# EAGLE design logic_pirate (EAGLE 6.4)
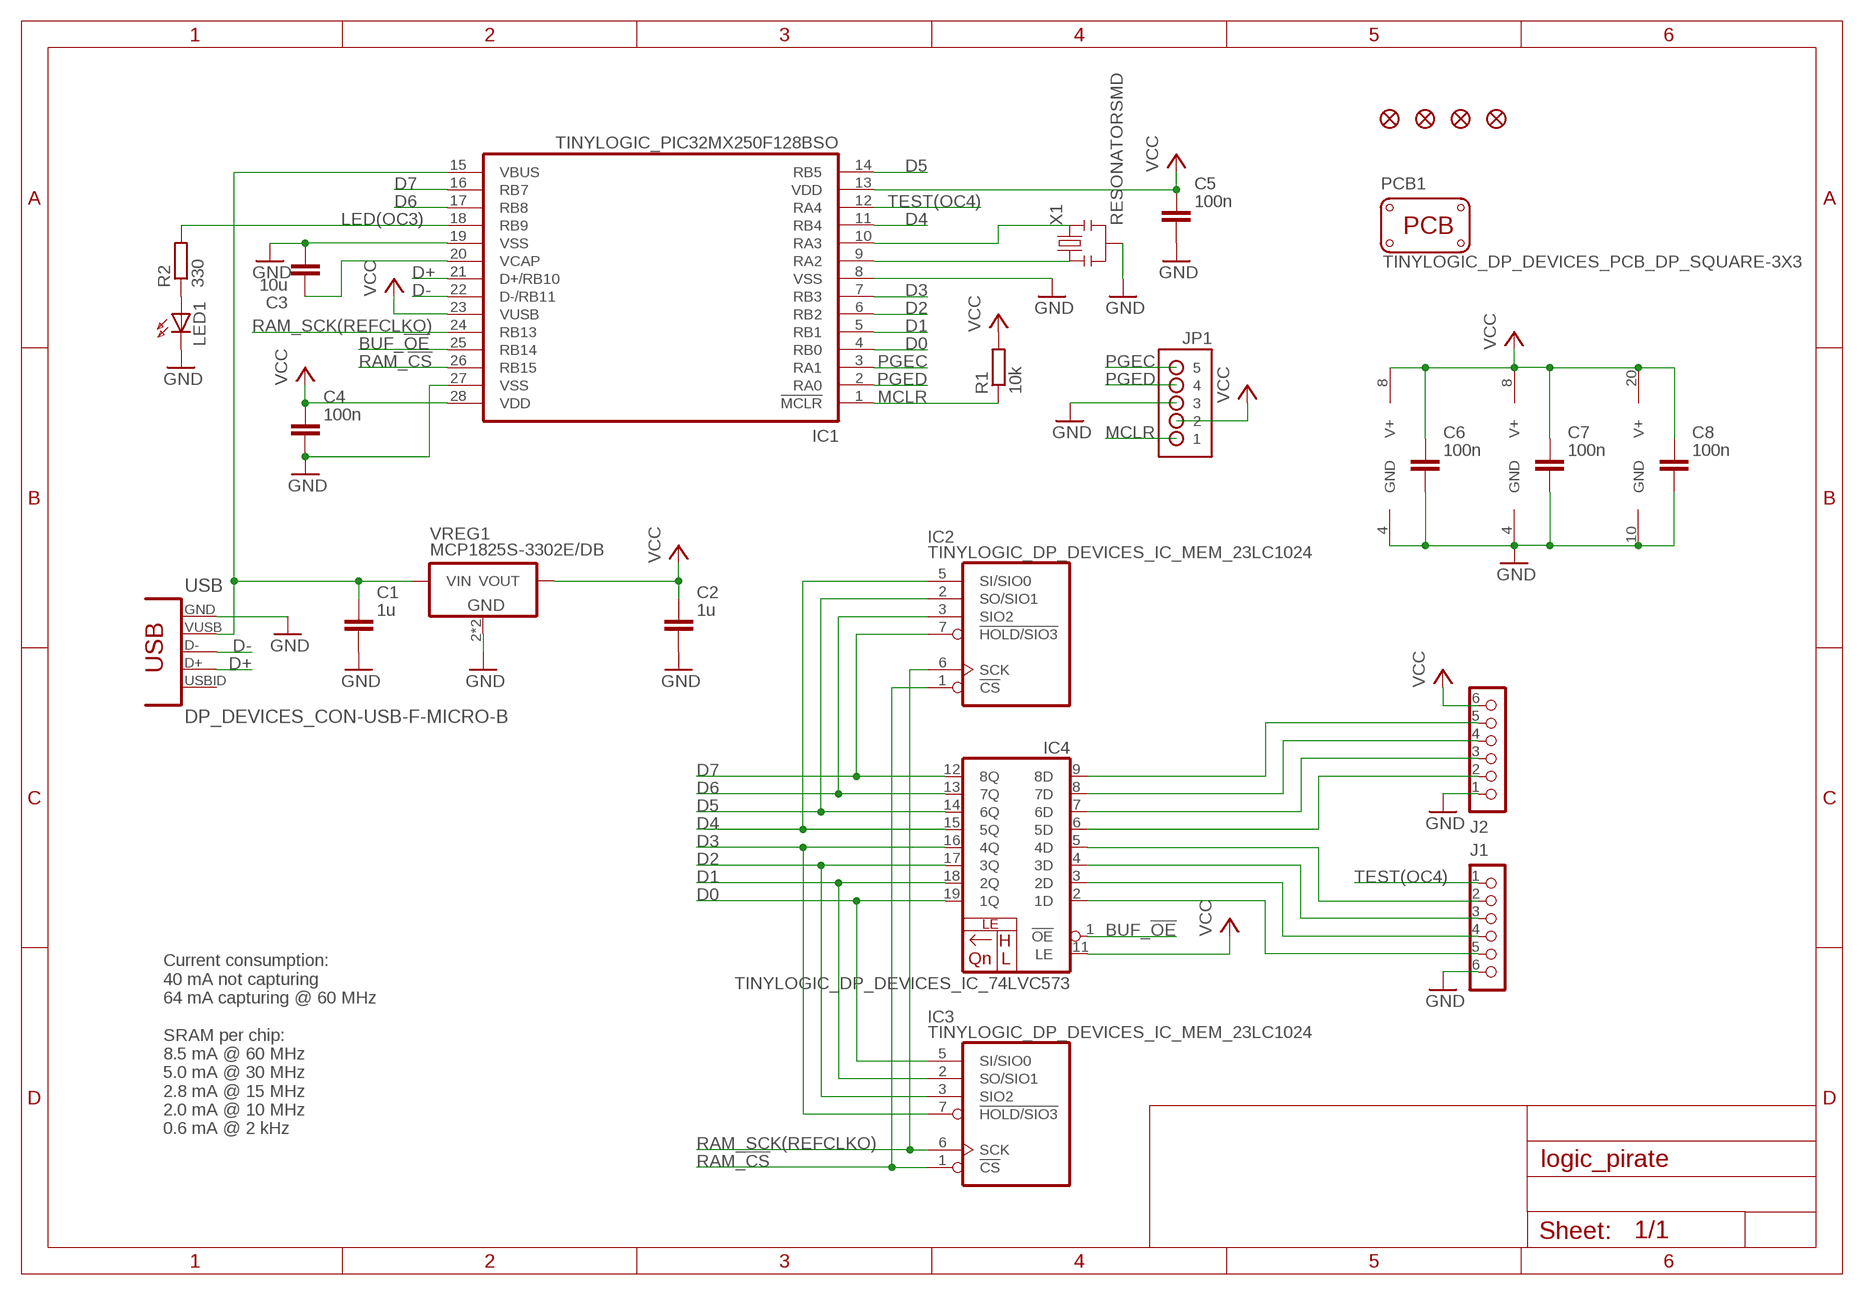
[diagram p0: schematic, sheet 1]

## Parts
C1  1u  DP_DEVICES_CAPACITOR_NPOL-0603  [DP_DEVICES_C603]
C2  1u  DP_DEVICES_CAPACITOR_NPOL-0603  [DP_DEVICES_C603]
C3  10u  CAPACITOR_NPOL-1206  [C1206]
C4  100n  DP_DEVICES_CAPACITOR_NPOL-0603  [DP_DEVICES_C603]
C5  100n  DP_DEVICES_CAPACITOR_NPOL-0603  [DP_DEVICES_C603]
C6  100n  DP_DEVICES_CAPACITOR_NPOL-0603  [DP_DEVICES_C603]
C7  100n  DP_DEVICES_CAPACITOR_NPOL-0603  [DP_DEVICES_C603]
C8  100n  DP_DEVICES_CAPACITOR_NPOL-0603  [DP_DEVICES_C603]
IC1  TINYLOGIC_PIC32MX250F128BSO  [TINYLOGIC_DP_DEVICES_SOIC-28W]
IC2  TINYLOGIC_DP_DEVICES_IC_MEM_23LC1024  [TINYLOGIC_DP_DEVICES_SOIC-8]
IC3  TINYLOGIC_DP_DEVICES_IC_MEM_23LC1024  [TINYLOGIC_DP_DEVICES_SOIC-8]
IC4  TINYLOGIC_DP_DEVICES_IC_74LVC573  [TINYLOGIC_DP_DEVICES_SOIC-20]
J1  DP_DEVICES_CON_HEADER_1X06-SMD-RIGHT-ANGLED  [DP_DEVICES_M1X6_MALE_RIGHT_ANGLED_SMD]
J2  DP_DEVICES_CON_HEADER_1X06-SMD-RIGHT-ANGLED  [DP_DEVICES_M1X6_MALE_RIGHT_ANGLED_SMD]
JP1  TINYLOGIC_CHIPKIT_UNO32_MECHANICAL_HDR-1X5-OFFSET  [TINYLOGIC_CHIPKIT_UNO32_MECHANICAL_HDR-1X6_OFFSET]
JP2  FIDUCIAL1X2  [FIDUCIAL-1X2]
JP3  FIDUCIAL1X2  [FIDUCIAL-1X2]
JP4  FIDUCIAL1X2  [FIDUCIAL-1X2]
JP5  FIDUCIAL1X2  [FIDUCIAL-1X2]
LED1  Status  CHIPKIT_UNO32_DISCRETE_LED-S0603  [CHIPKIT_UNO32_DISCRETE_D0603]
PCB1  TINYLOGIC_DP_DEVICES_PCB_DP_SQUARE-3X3  [TINYLOGIC_DP_DEVICES_DP3030_V1]
R1  10k  DP_DEVICES_RESISTOR-0603  [DP_DEVICES_R603]
R2  330  DP_DEVICES_RESISTOR-0603  [DP_DEVICES_R603]
USB  DP_DEVICES_CON-USB-F-MICRO-B  [DP_DEVICES_CONN_USB_MICRO-B]
VREG1  MCP1825S-3302E/DB  DP_DEVICES_VREG_3PINS-SOT-223  [DP_DEVICES_SOT-223]
X1  RESONATORSMD  [RESONATOR-SMD]

## Nets
BUF_!OE!: IC1.25(RB14) IC4.1(!OE)
D0: IC1.4(RB0) IC3.5(SI/SIO0) IC4.19(1Q)
D1: IC1.5(RB1) IC3.2(SO/SIO1) IC4.18(2Q)
D2: IC1.6(RB2) IC3.3(SIO2) IC4.17(3Q)
D3: IC1.7(RB3) IC3.7(!HOLD/SIO3) IC4.16(4Q)
D4: IC1.11(RB4) IC2.5(SI/SIO0) IC4.15(5Q)
D5: IC1.14(RB5) IC2.2(SO/SIO1) IC4.14(6Q)
D6: IC1.17(RB8) IC2.3(SIO2) IC4.13(7Q)
D7: IC1.16(RB7) IC2.7(!HOLD/SIO3) IC4.12(8Q)
D+: IC1.21(D+/RB10) USB.P3(D+)
D-: IC1.22(D-/RB11) USB.P2(D-)
GND: C1.2 C2.2 C3.2 C4.2 C5.2 C6.2 C7.2 C8.2 IC1.8(VSS) IC1.19(VSS) IC1.27(VSS) IC2.4(GND) IC3.4(GND) IC4.10(GND) J1.6 J2.1 JP1.3 LED1.C USB.P5(GND) VREG1.2(GND) VREG1.4(GND) X1.2
LED(OC3): IC1.18(RB9) R2.2
MCLR: IC1.1(!MCLR) JP1.1 R1.1
N$1: IC4.2(1D) J1.5
N$2: IC4.3(2D) J1.4
N$3: IC4.4(3D) J1.3
N$4: IC4.5(4D) J1.2
N$5: IC4.6(5D) J2.2
N$6: IC4.7(6D) J2.3
N$7: IC4.8(7D) J2.4
N$8: IC4.9(8D) J2.5
N$9: LED1.A R2.1
N$10: IC1.10(RA3) X1.3
N$11: IC1.9(RA2) X1.1
N$19: C3.1 IC1.20(VCAP)
PGEC: IC1.3(RA1) JP1.5
PGED: IC1.2(RA0) JP1.4
RAM_!CS!: IC1.26(RB15) IC2.1(!CS) IC3.1(!CS)
RAM_SCK(REFCLKO): IC1.24(RB13) IC2.6(SCK) IC3.6(SCK)
TEST(OC4): IC1.12(RA4) J1.1
VBUS: C1.1 IC1.15(VBUS) USB.P1(VUSB) VREG1.1(VIN)
VCC: C2.1 C4.1 C5.1 C6.1 C7.1 C8.1 IC1.13(VDD) IC1.23(VUSB) IC1.28(VDD) IC2.8(V+) IC3.8(V+) IC4.11(LE) IC4.20(V+) J2.6 JP1.2 R1.2 VREG1.3(VOUT)
Unconnected: USB.BODY@1(BODY) USB.BODY@2(BODY) USB.BODY@3(BODY) USB.BODY@4(BODY) USB.P4(USBID)

## Notes on the sheet
- Current consumption:
  40 mA not capturing
  64 mA capturing @ 60 MHz
  
  SRAM per chip:
  8.5 mA @ 60 MHz
  5.0 mA @ 30 MHz
  2.8 mA @ 15 MHz
  2.0 mA @ 10 MHz
  0.6 mA @ 2 kHz

## Library data of the parts
C1 C2 C4-C8 = TinyLogic:DP_DEVICES_CAPACITOR_NPOL: Non-Polarized capacitor in various packages
C3 = dp_devices:CAPACITOR_NPOL: Non-Polarized capacitor in various packages
IC1 = TinyLogic:TINYLOGIC_PIC32MX250F128B
IC2 IC3 = TinyLogic:TINYLOGIC_DP_DEVICES_IC_MEM_23LC1024: 1Mbit SPI SRAM with Serial dual interface and Serial quad interface
IC4 = logic_pirate:TINYLOGIC_DP_DEVICES_IC_74LVC573: 8 Transparent Latch with 3-state output Mfr no: SN74AC573NSR Digikey <http://www.digikey.com/product-detail/en/SN74AC573NSR/296-29119-1-ND/2690568>
J1 J2 = TinyLogic:DP_DEVICES_CON_HEADER_1X06
JP1 = logic_pirate:TINYLOGIC_CHIPKIT_UNO32_MECHANICAL_HDR-1X5-OFFSET: 42 mil hole pattern with 16mil offset for jtag connector
JP2-JP5 = SparkFun:FIDUCIAL: Fiducial Alignment Points Various fiducial points for machine vision alignment.
LED1 = TinyLogic:CHIPKIT_UNO32_DISCRETE_LED: Discrete LED
PCB1 = TinyLogic:TINYLOGIC_DP_DEVICES_PCB_DP_SQUARE: Dangerous Prototypes Standard Square PCB sizes
R1 R2 = TinyLogic:DP_DEVICES_RESISTOR
USB = TinyLogic:DP_DEVICES_CON-USB-F: USB Female connector
VREG1 = TinyLogic:DP_DEVICES_VREG_3PINS: Various 3 pin voltage regulators in different packages Double check the right pinout for the right part
X1 = SparkFun02-20-08:RESONATOR: Resonator Small SMD resonator. This is the itty bitty 10/20MHz resonators with built in caps. CSTCE10M0G55 and CSTCE20M0V53. Footprint has been reviewed closely but hasn t been tested yet.'

## Board
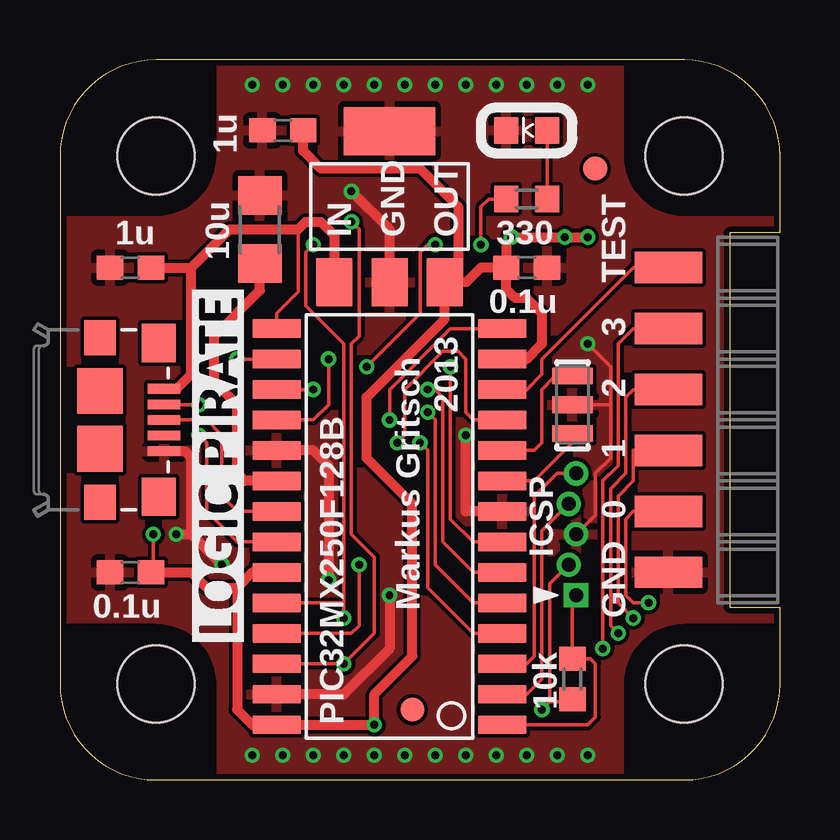
[diagram p1: board, top side]
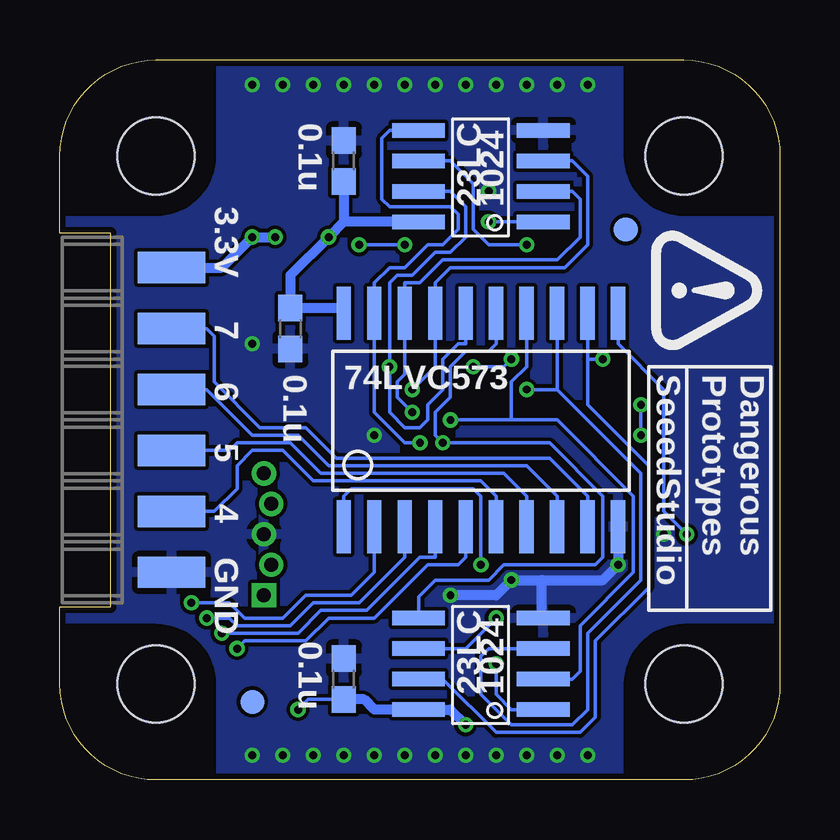
[diagram p2: board, bottom side, seen from below]

Size 30 x 30 mm. Coordinates in mm from the lower left corner, seen from the top.
Copper layers (1*16): Top 0.035mm / dielectric 1.5mm / Bottom 0.035mm
Design rules "Fusion_eagle_rule_v1.1 *": minimum track width 6mil, minimum drill 12mil, track to track 6mil, track to pad 6mil, pad to pad 6mil, via to via 6mil, smd to smd 0mil, copper to edge 10mil, drill to drill 10mil, minimum pad ring 8mil, minimum via ring 6mil, stop-mask expansion 2mil, vias tented up to drill 100mil, thermal gap 10mil

### Footprints (pad centres in the part's own frame; a part is rotated, then mirrored left to right if it is on the bottom)
DP_DEVICES_C603 = smd 1.1 x 1: 1 -0.85,0; 2 0.85,0
C1206 = smd 1.6 x 1.803: 1 -1.422,0; 2 1.422,0
TINYLOGIC_DP_DEVICES_SOIC-28W = smd 0.762 x 2: 1 -8.89,-4.7; 2 -7.62,-4.7; 3 -6.35,-4.7; 4 -5.08,-4.7; 5 -3.81,-4.7; 6 -2.54,-4.7; 7 -1.27,-4.7; 8 0,-4.7; 9 1.27,-4.7; 10 2.54,-4.7; 11 3.81,-4.7; 12 5.08,-4.7; 13 6.35,-4.7; 14 7.62,-4.7; 15 7.62,4.7; 16 6.35,4.7; 17 5.08,4.7; 18 3.81,4.7; 19 2.54,4.7; 20 1.27,4.7; 21 0,4.7; 22 -1.27,4.7; 23 -2.54,4.7; 24 -3.81,4.7; 25 -5.08,4.7; 26 -6.35,4.7; 27 -7.62,4.7; 28 -8.89,4.7
TINYLOGIC_DP_DEVICES_SOIC-8 = smd 0.6 x 2.2: 1 -1.905,-2.6; 2 -0.635,-2.6; 3 0.635,-2.6; 4 1.905,-2.6; 5 1.905,2.6; 6 0.635,2.6; 7 -0.635,2.6; 8 -1.905,2.6
TINYLOGIC_DP_DEVICES_SOIC-20 = smd 0.6 x 2.2: 1 -5.715,-4.445; 2 -4.445,-4.445; 3 -3.175,-4.445; 4 -1.905,-4.445; 5 -0.635,-4.445; 6 0.635,-4.445; 7 1.905,-4.445; 8 3.175,-4.445; 9 4.445,-4.445; 10 5.715,-4.445; 11 5.715,4.445; 12 4.445,4.445; 13 3.175,4.445; 14 1.905,4.445; 15 0.635,4.445; 16 -0.635,4.445; 17 -1.905,4.445; 18 -3.175,4.445; 19 -4.445,4.445; 20 -5.715,4.445
DP_DEVICES_M1X6_MALE_RIGHT_ANGLED_SMD = smd 1.3 x 2.8: 1 -6.35,-3.3; 2 -3.81,-3.3; 3 -1.27,-3.3; 4 1.27,-3.3; 5 3.81,-3.3; 6 6.35,-3.3
TINYLOGIC_CHIPKIT_UNO32_MECHANICAL_HDR-1X6_OFFSET = drill 0.584 pad 1.016 square: 1 -0.152,2.54 | drill 0.584 pad 1.016: 2 0.152,1.27; 3 -0.152,0; 4 0.152,-1.27; 5 -0.152,-2.54
FIDUCIAL-1X2 = smd 1 x 1: 1 0,0
CHIPKIT_UNO32_DISCRETE_D0603 = smd 1 x 1.1: A 0.85,0; C -0.85,0
TINYLOGIC_DP_DEVICES_DP3030_V1 = hole 3.2: 4,4; 26,4; 26,26; 4,26
DP_DEVICES_R603 = smd 1 x 1.1: 1 -0.85,0; 2 0.85,0
DP_DEVICES_CONN_USB_MICRO-B = smd 1.6 x 1.4: BODY@1 -3.2,2.45; BODY@2 3.2,2.45 | smd 1.45 x 1.3: BODY@3 3.425,0; BODY@6 -3.425,0 | smd 1.9 x 1.9: BODY@4 1.2,0; BODY@5 -1.2,0 | smd 0.4 x 1.35: P1 -1.3,2.675; P2 -0.65,2.675; P3 0,2.675; P4 0.65,2.675; P5 1.3,2.675
DP_DEVICES_SOT-223 = smd 1.5 x 2: 1 -2.3,-3.15; 2 0,-3.15; 3 2.3,-3.15 | smd 3.8 x 2: 4 0,3.15
RESONATOR-SMD = smd 0.7 x 1.7: 1 -1.2,0; 2 0,0; 3 1.2,0

### Placement (x,y rotation side)
C1  2.93,21.35 180 top
C2  9.29,27.07 180 top
C3  8.33,22.94 90 top
C4  2.93,8.65 180 top
C5  19.45,21.35 0 top
C6  18.18,4.21 90 bottom
C7  18.18,25.8 90 bottom
C8  20.4,18.81 270 bottom
IC1  13.73,11.19 90 top
IC2  12.46,4.84 90 bottom
IC3  12.46,25.16 90 bottom
IC4  12.46,15 0 bottom
J1  28.65,15 270 top
J2  28.65,15 90 bottom
JP1  21.35,10.24 180 top
JP2  22.3,25.48 0 top
JP3  14.68,2.93 0 top
JP4  21.99,3.25 0 bottom
JP5  6.43,22.94 0 bottom
LED1  19.45,27.07 0 top
PCB1  0,0 0 top
R1  21.35,4.21 270 top
R2  19.45,24.21 180 top
U$1  [LP_LOGO]  6.59,13.1 90 top
U$4  [TINY_LOGO]  3.57,20.4 180 bottom
USB  1.67,15 270 top
VREG1  13.73,23.89 0 top
X1  21.35,15.63 90 top

### Tracks (layer width: path | path; a pad name or v marks a point on that pad's centre or on a via)
BUF_!OE!  (via drill 0.33)
  Top 0.152: v12.46,8.97 12.46,6.43 12.14,6.11 IC1.25
  Bottom 0.152: IC4.1 18.18,11.82 17.86,12.14 12.78,12.14 12.46,11.82 v12.46,8.97
D0  (via drill 0.33)
  Top 0.152: v15,14.05 15.32,13.73 15.32,8.02 17.22,6.11 IC1.4
  Bottom 0.152: IC3.5 16.27,27.07 16.59,26.75 16.59,24.21 16.27,23.89 13.73,23.89 13.41,23.57 13.41,22.94 14.05,22.3 14.68,22.3 15.63,21.35 16.27,21.35 16.91,20.71 IC4.19 16.91,15.32 15.63,14.05 v15,14.05
D1  (via drill 0.33)
  Top 0.152: IC1.5 17.22,7.38 15.63,8.97 15.63,15 v15.32,15.32
  Bottom 0.152: IC3.2 8.65,24.53 8.33,24.21 8.33,22.62 9.29,21.67 14.05,21.67 15,20.71 15.63,20.71 IC4.18 15.63,16.91 15.95,16.59 15.95,15.95 v15.32,15.32
D2  (via drill 0.33)
  Top 0.152: IC1.6 17.22,8.65 15.95,9.92 15.95,15.95 15.63,16.27 v15.32,16.27
  Bottom 0.152: IC3.3 8.65,25.8 8.02,25.16 8.02,22.3 8.97,21.35 13.73,21.35 14.37,20.71 IC4.17 14.37,17.22 v15.32,16.27
D3  (via drill 0.33)
  Top 0.152: IC1.7 17.22,9.92 16.27,10.87 v16.27,17.22
  Bottom 0.152: IC3.7 13.73,24.53 13.1,23.89 13.1,22.62 13.73,21.99 14.37,21.99 15.32,21.03 15.95,21.03 16.27,20.71 v16.27,17.22 16.27,15.32 15.63,14.68 15,14.68 14.68,15 14.68,15.63 14.05,16.27 14.05,17.54 13.41,18.18 13.1,18.18 IC4.16
D4  (via drill 0.33)
  Top 0.152: IC1.11 17.22,15 16.91,15.32 16.91,17.54 16.59,17.86 15.95,17.86 14.37,16.27 14.37,14.37 v14.05,14.05
  Bottom 0.152: IC4.15 11.82,18.18 12.14,17.86 13.1,17.86 13.73,17.22 13.73,15.95 14.37,15.32 14.37,14.37 v14.05,14.05 9.6,14.05 7.38,11.82 7.38,9.29 7.7,8.97 11.51,8.97 12.14,8.33 14.37,8.33 15.06,7.64 IC2.5
D5  (via drill 0.33)
  Top 0.152: IC1.14 16.27,18.81 13.73,16.27 v13.73,15
  Bottom 0.152: IC4.14 10.55,17.22 11.19,16.59 11.19,15 | v13.73,15 11.19,15 | 11.19,15 9.29,15 6.11,11.82 6.11,8.65 8.33,6.43 8.33,4.52 8.65,4.21 IC2.2
D6  (via drill 0.33)
  Top 0.152: IC1.17 v10.55,16.27
  Bottom 0.152: IC4.13 9.29,16.27 | 9.29,16.27 5.79,12.78 5.79,8.33 8.02,6.11 8.02,2.93 8.65,2.3 11.19,2.3 12.46,3.57 12.46,5.16 12.14,5.47 IC2.3 | 9.29,16.27 v10.55,16.27
D7  (via drill 0.33)
  Top 0.152: IC1.16 v7.38,17.54
  Bottom 0.152: IC4.12 8.02,17.54 | 8.02,17.54 8.02,15.63 5.47,13.1 5.47,8.02 7.7,5.79 7.7,2.62 8.33,1.98 11.82,1.98 14.05,4.21 IC2.7 | v7.38,17.54 8.02,17.54
D+
  Top 0.152: USB.P3 6.11,15 6.75,14.37 6.75,11.82 7.38,11.19 IC1.21
D-  (via drill 0.33)
  Top 0.152: USB.P2 4.35,15.63 v5.79,15.63 | v5.79,14.37 6.11,14.05 6.11,11.19 7.38,9.92 IC1.22
  Bottom 0.152: v5.79,15.63 v5.79,14.37
GND  (via drill 0.33)
  Top 0.152: 22.94,15.63 22.94,13.41 22.3,12.78 22.3,11.04 JP1.3 | 22.94,15.63 22.94,17.22 v21.99,18.18 | X1.2 22.94,15.63
  Top 0.406: J1.6 24.53,8.65 | v6.75,8.97 5.47,10.24 | v11.19,8.33 11.19,13.1 10.55,13.73 IC1.19 | IC1.8 16.91,11.19 v16.91,14.37 | v13.73,7.7 13.73,5.47 11.82,3.57 IC1.27 | v4.84,10.24 5.47,10.24 | 5.47,10.24 5.47,13.41 5.19,13.7 USB.P5 | VREG1.2 13.73,22.94 v12.14,24.53
  Bottom 0.406: IC4.10 v6.75,8.97 7.38,8.33 9.92,8.33 | 9.92,8.33 v11.19,8.33 11.82,7.7 v13.73,7.7 | IC2.4 9.92,6.75 9.92,8.33
  other vias: 8.02,28.97 9.29,28.97 10.55,28.97 11.82,28.97 13.1,28.97 14.37,28.97 15.63,28.97 16.91,28.97 18.18,28.97 19.45,28.97 20.71,28.97 21.99,28.97 21.99,1.03 20.71,1.03 19.45,1.03 18.18,1.03 16.91,1.03 15.63,1.03 8.02,1.03 9.29,1.03 10.55,1.03 11.82,1.03 13.1,1.03 14.37,1.03
  pour Bottom: -0.24,30.24 -0.24,-0.24 30.24,-0.24 30.24,30.24
  pour Top: -0.24,30.24 30.24,30.24 30.24,-0.24 -0.24,-0.24
LED(OC3)  (via drill 0.33)
  Top 0.152: v12.78,17.22 15,19.45 15,21.99 15.32,22.3 v15.63,22.3 | v11.19,17.54 11.19,15.63 10.55,15 IC1.18 | v17.54,22.3 17.54,23.89 17.86,24.21 R2.2
  Bottom 0.152: v12.78,17.22 11.51,17.22 v11.19,17.54 | v17.54,22.3 v15.63,22.3
MCLR
  Top 0.152: IC1.1 21.99,2.3 22.3,2.62 22.3,4.84 22.09,5.05 R1.1 21.35,7.54 JP1.1
N$1  (via drill 0.33)
  Top 0.152: J1.5 23.89,11.19 23.57,10.87 23.57,7.7 23.89,7.38 v24.53,7.38
  Bottom 0.152: v24.53,7.38 22.94,7.38 22.3,6.75 20.71,6.75 19.76,7.7 17.86,7.7 16.91,8.65 IC4.2
N$2  (via drill 0.33)
  Top 0.152: v23.89,6.75 23.26,7.38 23.26,11.82 23.89,12.46 23.89,13.73 J1.4
  Bottom 0.152: v23.89,6.75 22.94,6.75 22.62,6.43 20.4,6.43 19.45,7.38 17.54,7.38 15.63,9.29 IC4.3
N$3  (via drill 0.33)
  Top 0.152: J1.3 23.89,16.27 23.57,15.95 23.57,12.78 22.94,12.14 22.94,6.43 v23.26,6.11
  Bottom 0.152: v23.26,6.11 20.08,6.11 19.13,7.06 17.22,7.06 15,9.29 14.37,9.29 IC4.4
N$4  (via drill 0.33)
  Top 0.152: J1.2 23.89,18.81 23.26,18.18 23.26,13.1 22.62,12.46 v22.62,5.47
  Bottom 0.152: v22.62,5.47 22.3,5.79 19.76,5.79 18.81,6.75 16.91,6.75 14.68,8.97 13.41,8.97 13.1,9.29 IC4.5
N$5
  Bottom 0.152: J2.2 23.57,11.19 22.62,12.14 22.62,13.1 21.99,13.73 20.71,13.73 19.45,12.46 12.46,12.46 11.82,11.82 IC4.6
N$6
  Bottom 0.152: J2.3 22.94,13.73 22.62,14.05 20.4,14.05 19.13,12.78 11.51,12.78 10.55,11.82 IC4.7
N$7
  Bottom 0.152: J2.4 23.89,16.27 21.99,14.37 20.08,14.37 18.81,13.1 10.55,13.1 9.29,11.82 IC4.8
N$8
  Bottom 0.152: J2.5 23.89,18.81 23.57,18.49 23.57,16.59 21.67,14.68 19.76,14.68 18.49,13.41 9.6,13.41 8.02,11.82 IC4.9
N$9
  Top 0.152: R2.1 LED1.A
N$10
  Top 0.152: IC1.10 19.76,13.73 20.08,14.05 20.08,16.27 20.65,16.84 X1.3
N$11
  Top 0.152: IC1.9 19.76,12.46 21.35,14.05 X1.1
N$19
  Top 0.406: IC1.20 7.7,12.46 7.38,12.78 7.38,15.63 6.43,16.59 6.43,18.49 8.33,20.4 C3.1
PGEC
  Top 0.152: IC1.3 19.45,4.84 19.76,5.16 19.76,11.82 20.71,12.78 JP1.5
PGED
  Top 0.152: IC1.2 19.45,3.57 20.08,4.21 20.08,10.39 JP1.4
RAM_!CS!  (via drill 0.33)
  Top 0.152: v12.14,23.26 12.46,22.94 12.46,18.49 12.14,18.18 12.14,10.24 13.1,9.29 13.1,6.11 v11.82,4.84 IC1.26
  Bottom 0.152: IC3.1 v12.14,23.26 | v11.82,4.84 11.82,3.57 11.19,2.93 IC2.1
RAM_SCK(REFCLKO)  (via drill 0.33)
  Top 0.152: v10.55,22.3 10.24,21.99 10.24,19.76 11.82,18.18 11.82,7.38 | IC1.24 11.82,7.38 | 11.82,7.38 v11.82,6.75
  Bottom 0.152: IC3.6 13.73,25.8 12.78,24.84 12.78,22.94 12.14,22.3 v10.55,22.3 | v11.82,6.75 13.1,5.47 IC2.6
TEST(OC4)
  Top 0.152: IC1.12 19.45,16.27 20.08,16.91 20.08,17.54 23.89,21.35 J1.1
VBUS
  Top 0.152: 9.92,22.94 9.92,20.34 9.03,19.45 IC1.15
  Top 0.406: USB.P1 4.87,16.3 5.47,16.91 5.47,21.35 | 5.47,21.35 7.06,22.94 9.92,22.94 10.24,23.26 10.87,23.26 11.43,22.7 VREG1.1 | C1.1 5.47,21.35
VCC  (via drill 0.33)
  Top 0.152: v3.89,10.24 v3.88,10.23 3.88,8.65 C4.1 | 20.4,3.25 20.4,8.17 JP1.2 | v20.08,2.93 20.4,3.25 | 20.4,3.25 21.25,3.25 R1.2
  Top 0.406: C4.1 5.47,8.65 6.11,8.02 7.38,8.02 | IC1.23 8.02,8.65 7.38,8.02 | 7.38,8.02 7.38,2.93 8.02,2.3 IC1.28 v13.1,2.3 13.1,3.57 14.68,5.16 14.68,11.51 12.78,13.41 12.78,15.95 16.03,19.21 VREG1.3 | C5.1 17.54,21.35 16.93,20.74 VREG1.3 | IC1.13 19.45,17.54 20.08,18.18 20.08,19.45 19.45,20.08 18.97,20.08 18.6,20.45 C5.1 | v21.99,22.62 v18.81,22.62 18.6,22.41 C5.1 | C2.1 10.13,26.21 10.87,25.48 15,25.48 16.59,23.89 16.59,20.74 VREG1.3
  Bottom 0.152: IC4.11 6.75,18.18 4.84,16.27 4.84,11.19 v3.89,10.24 | v20.08,2.93 19.66,3.36 C6.1
  Bottom 0.305: J2.6 26.43,21.35
  Bottom 0.406: v13.1,2.3 13.73,2.93 IC2.8 16.91,2.93 17.33,3.36 C6.1 | J2.6 23.26,21.35 v21.99,22.62 v21.03,22.62 | IC3.8 18.18,23.26 | C7.1 18.18,23.26 | IC4.20 18.18,19.76 18.28,19.66 C8.1 20.4,21.03 v18.81,22.62 18.18,23.26

### Text on the board
tPlace: 1u | 1u | IN | GND | OUT | 330 | 10u | TEST | 0.1u | 3 | 2013 | 2 | 1 | 0 | ICSP | 0.1u | Markus Gritsch | GND | PIC32MX250F128B | 10k
bPlace: 0.1u | 1024 | 23LC | 3.3V | 7 | Dangerous | Prototypes | SeeedStudio | 74LVC573 | 0.1u | 6 | 5 | 4 | GND | 0.1u | 1024 | 23LC